# EAGLE design doorbell-controller (EAGLE 8.6.3)
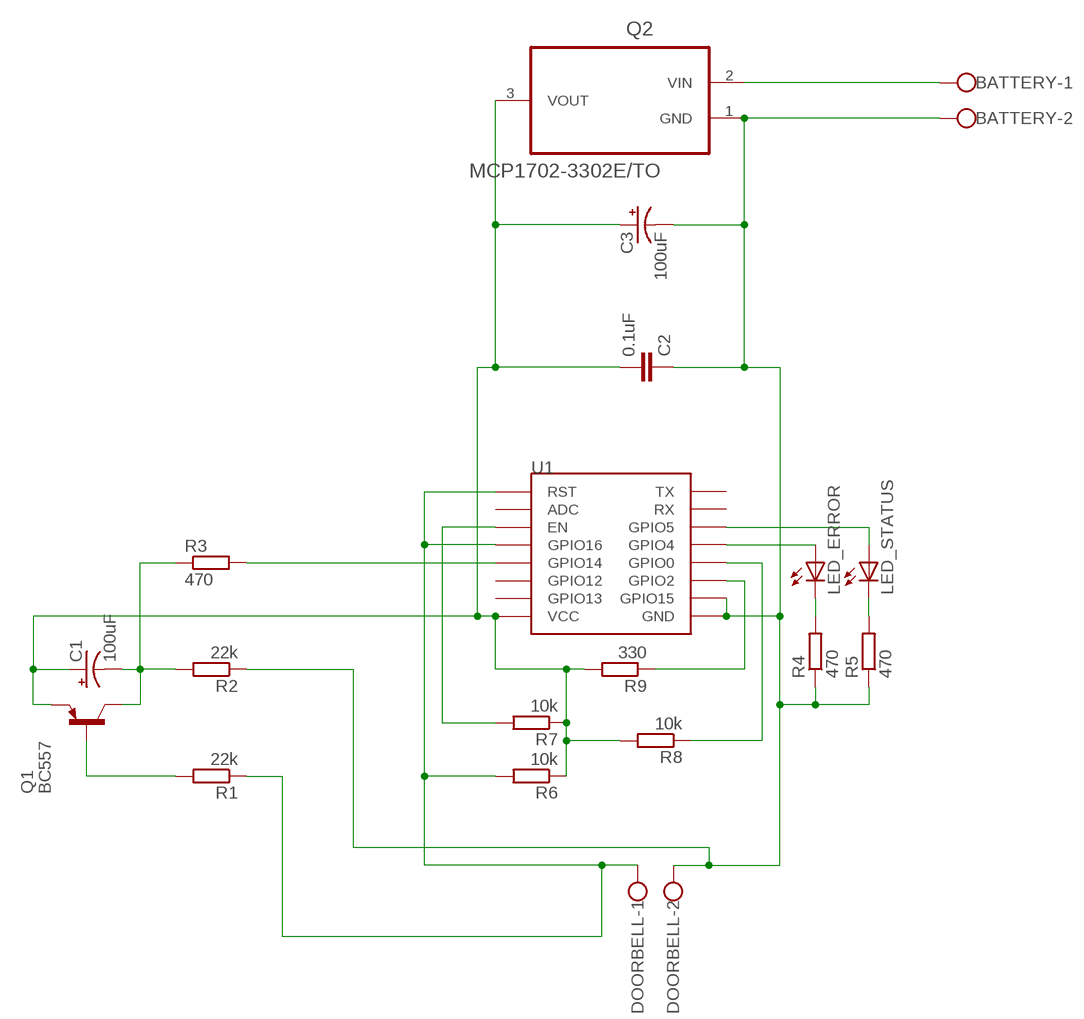
[diagram p0: schematic, sheet 1]

## Parts
BATTERY  W237-102  [W237-102]
C1  100uF  CPOL-USE2,5-6E  [E2,5-6E]
C2  0.1uF  C-EU025-025X050  [C025-025X050]
C3  100uF  CPOL-USE2,5-6E  [E2,5-6E]
DOORBELL  W237-102  [W237-102]
LED_ERROR  LED5MM  [LED5MM]
LED_STATUS  LED5MM  [LED5MM]
Q1  BC557  [TO92]
Q2  MCP1702-3302E/TO  [TO127P254X533-3]
R1  22k  R-EU_0204/7  [0204/7]
R2  22k  R-EU_0204/7  [0204/7]
R3  470  R-EU_0204/7  [0204/7]
R4  470  R-EU_0204/7  [0204/7]
R5  470  R-EU_0204/7  [0204/7]
R6  10k  R-EU_0204/7  [0204/7]
R7  10k  R-EU_0204/7  [0204/7]
R8  10k  R-EU_0204/7  [0204/7]
R9  330  R-EU_0204/7  [0204/7]
U1  ESP12-TR  [ESP12-TR]

## Nets
BATT_VIN: BATTERY.1 Q2.2(VIN)
GND: BATTERY.2 C2.1 C3.- DOORBELL.2 Q2.1(GND) R2.1 R4.1 R5.1 U1.GND U1.GPIO15
N$1: LED_STATUS.A U1.GPIO5
N$2: Q1.2(B) R1.2
N$3: R3.2 U1.GPIO14
N$4: LED_ERROR.A U1.GPIO4
N$5: C1.- Q1.3(C) R2.2 R3.1
N$6: LED_ERROR.K(C) R4.2
N$7: LED_STATUS.K(C) R5.2
N$9: R9.1 U1.GPIO2
N$10: R7.2 U1.EN
N$11: R8.1 U1.GPIO0
RST: DOORBELL.1 R1.1 R6.2 U1.GPIO16 U1.RST
VCC: C1.+ C2.2 C3.+ Q1.1(E) Q2.3(VOUT) R6.1 R7.1 R8.2 R9.2 U1.VCC
Unconnected: U1.ADC U1.GPIO12 U1.GPIO13 U1.RX U1.TX

## Library data of the parts
BATTERY DOORBELL = con-wago-500:W237-102: WAGO SCREW CLAMP; MPN: 237-102; OC_FARNELL: unknown; OC_NEWARK: 70K9898
C1 C3 = rcl:CPOL-US: POLARIZED CAPACITOR, American symbol; SPICEPREFIX: C
C2 = rcl:C-EU: CAPACITOR, European symbol; SPICEPREFIX: C
LED_ERROR LED_STATUS = led:LED: LED OSRAM: - CHIPLED LG R971, LG N971, LY N971, LG Q971, LY Q971, LO R971, LY R971 LH N974, LH R974 LS Q976, LO Q976, LY Q976 LO Q996 - Hyper CHIPLED LW Q18S LB Q993, LB Q99A, LB R99A - SideLED LS A670, LO A670, LY A670, LG A670, LP A670 LB A673, LV A673, LT A673, LW A673 LH A674 LY A675 LS A676, LA A676, LO A676, LY A676, LW A676 LS A679, LY A679, LG A679 - Hyper Micro SIDELED® LS Y876, LA Y876, LO Y876, LY Y876 LT Y87S - SmartLED LW L88C, LW L88S LB L89C, LB L89S, LG L890 LS L89K, LO L89K, LY L89K LS L896, LA L896, LO L896, LY L896 - TOPLED LS T670, LO T670, LY T670, LG T670, LP T670 LSG T670, LSP T670, LSY T670, LOP T670, LYG T670 LG T671, LOG T671, LSG T671 LB T673, LV T673, LT T673, LW T673 LH T674 LS T676, LA T676, LO T676, LY T676, LB T676, LH T676, LSB T676, LW T676 LB T67C, LV T67C, LT T67C, LS T67K, LO T67K, LY T67K, LW E67C LS E67B, LA E67B, LO E67B, LY E67B, LB E67C, LV E67C, LT E67C LW T67C LS T679, LY T679, LG T679 LS T770, LO T770, LY T770, LG T770, LP T770 LB T773, LV T773, LT T773, LW T773 LH T774 LS E675, LA E675, LY E675, LS T675 LS T776, LA T776, LO T776, LY T776, LB T776 LHGB T686 LT T68C, LB T68C - Hyper Mini TOPLED® LB M676 - Mini TOPLED Santana® LG M470 LS M47K, LO M47K, LY M47K Source: http://www.osram.convergy.de LUXEON: - LUMILED® LXK2-PW12-R00, LXK2-PW12-S00, LXK2-PW14-U00, LXK2-PW14-V00 LXK2-PM12-R00, LXK2-PM12-S00, LXK2-PM14-U00 LXK2-PE12-Q00, LXK2-PE12-R00, LXK2-PE12-S00, LXK2-PE14-T00, LXK2-PE14-U00 LXK2-PB12-K00, LXK2-PB12-L00, LXK2-PB12-M00, LXK2-PB14-N00, LXK2-PB14-P00, LXK2-PB14-Q00 LXK2-PR12-L00, LXK2-PR12-M00, LXK2-PR14-Q00, LXK2-PR14-R00 LXK2-PD12-Q00, LXK2-PD12-R00, LXK2-PD12-S00 LXK2-PH12-R00, LXK2-PH12-S00 LXK2-PL12-P00, LXK2-PL12-Q00, LXK2-PL12-R00 Source: www.luxeon.com KINGBRIGHT: KA-3528ASYC Source: www.kingbright.com
Q1 = transistor-pnp:BC557: PNP Transistor
Q2 = Microchip_By_element14_Batch_1:MCP1702-3302E/TO: IC, V REG, LDO, 250MA; MPN: MCP1702-3302E/TO; OC_FARNELL: 1331485; OC_NEWARK: 34M7419; PACKAGE: TO-92; SUPPLIER: Microchip
R1-R9 = rcl:R-EU_: RESISTOR, European symbol; SPICEPREFIX: R
U1 = esp8266modules:ESP12-TR: ESP8266 Wifi module 12

## Board
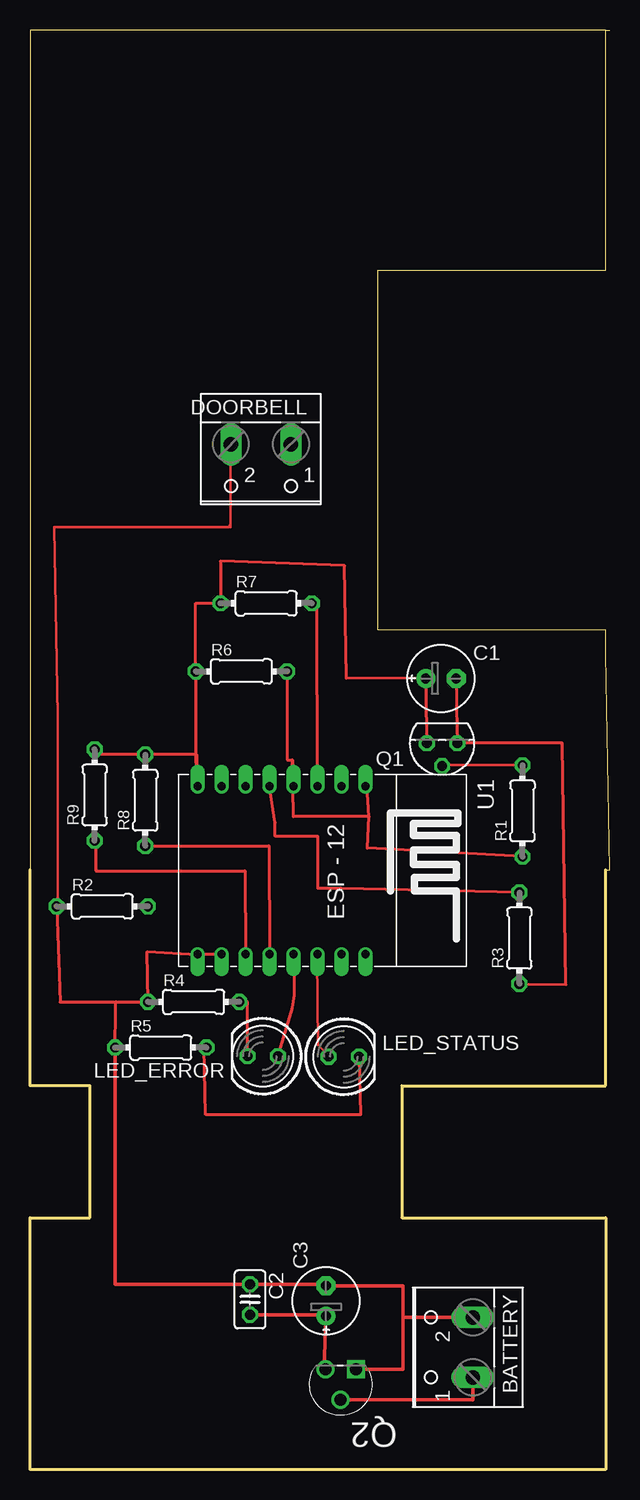
[diagram p1: board, top side]
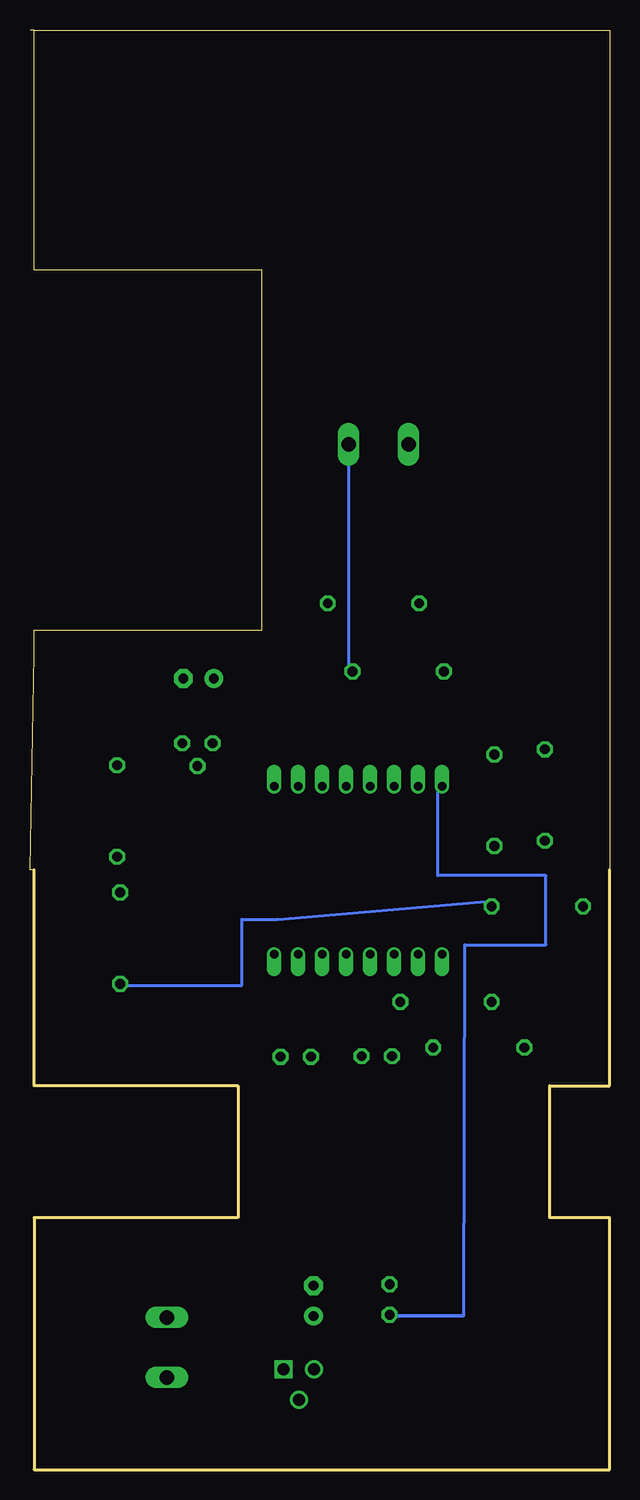
[diagram p2: board, bottom side, seen from below]

Size 48.34 x 120 mm. Coordinates in mm from the lower left corner, seen from the top.
Outline: 48,120 48,100 29,100 29,70 48,70 48,68 48.34,50 48,50 48,32 31,32 31,21 48,21 48,0 0,0 0,21 5,21 5,32 0,32 0,50 0,120 48,120
Outline: 48,120 48.34,120
Copper layers (1*16): Top 0.035mm / dielectric 1.5mm / Bottom 0.035mm
Design rules "default *": minimum track width 8mil, minimum drill 0.35mm, track to track 6mil, track to pad 6mil, pad to pad 6mil, via to via 6mil, smd to smd 6mil, copper to edge 40mil, drill to drill 6mil, minimum pad ring 10mil, minimum via ring 8mil, stop-mask expansion 4mil, vias tented up to drill 0mil, thermal gap 10mil

### Footprints (pad centres in the part's own frame; a part is rotated, then mirrored left to right if it is on the bottom)
W237-102 = drill 1.194 long: 1 -2.5,-1.27; 2 2.5,-1.27
E2,5-6E = drill 0.813 pad 1.575: + -1.27,0 | drill 0.813 pad 1.575 octagon: - 1.27,0
C025-025X050 = drill 0.813 octagon: 1 -1.27,0; 2 1.27,0
LED5MM = drill 0.813 octagon: A -1.27,0; K 1.27,0
TO92 = drill 0.813 octagon: 1 1.27,0; 2 0,1.905; 3 -1.27,0
TO127P254X533-3 = drill 0.991 square: 1 -2.54,-2.54 | drill 0.991: 2 -1.27,0; 3 0,-2.54
0204/7 = drill 0.813 octagon: 1 -3.81,0; 2 3.81,0
ESP12-TR = drill 0.7 offset: ADC -7.1,3.8; EN -7.1,1.8; GND 6.9,-8.2; GPIO0 6.9,-2.2; GPIO2 6.9,-4.2; GPIO4 6.9,-0.2; GPIO5 6.9,1.8; GPIO12 -7.1,-4.2; GPIO13 -7.1,-6.2; GPIO14 -7.1,-2.2; GPIO15 6.9,-6.2; GPIO16 -7.1,-0.2; RST -7.1,5.8; RX 6.9,3.8; TX 6.9,5.8; VCC -7.1,-8.2

### Placement (x,y rotation side)
BATTERY  35.66,10.18 90 top
C1  34.28,65.94 0 top
C2  18.35,14.17 270 top
C3  24.7,14.06 90 top
DOORBELL  19.26,84.2 180 top
LED_ERROR  19.41,34.45 180 top
LED_STATUS  26.18,34.41 0 top
Q1  34.37,60.54 180 top
Q2  24.64,5.82 180 top
R1  41.08,54.9 90 top
R2  6.03,46.95 0 top
R3  40.82,44.29 90 top
R4  13.65,38.98 0 top
R5  10.91,35.18 0 top
R6  17.63,66.53 0 top
R7  19.7,72.21 0 top
R8  9.61,55.79 90 top
R9  5.39,56.22 90 top
U1  22.18,49.85 270 top

### Tracks (layer width: path | path; a pad name or v marks a point on that pad's centre or on a via)
BATT_VIN
  Top 0.305: Q2.2 36.93,5.82 BATTERY.1
GND
  Top 0.203: 16.71,78.56 16.71,85.34 DOORBELL.2 | 16.71,78.56 2.01,78.56 2.31,62.76 2.31,47.12 R2.1 | 16.71,78.56 16.65,78.69
  Top 0.254: U1.GPIO15 U1.GND 9.78,43.17 R4.1 7.16,38.99 | R2.1 2.52,38.96 7.16,38.99 | R5.1 7.14,38.21 7.16,38.99
  Top 0.305: Q2.1 31.1,8.36 31.1,12.68 | 31.1,12.68 BATTERY.2 | 31.1,12.68 31.1,15.33 C3.- 24.7,15.44 C2.1 7.1,15.44 R5.1
N$1
  Top 0.203: U1.GPIO5 23.95,42.79 24,35.38 24.89,34.49 LED_STATUS.A
N$2
  Top 0.254: R1.2 34.74,58.67 Q1.2
N$3
  Top 0.254: R3.2 25.95,48.45 24.01,48.45 24.01,52.77 20.44,52.77 20.44,53.92 U1.GPIO14
N$4
  Top 0.254: LED_ERROR.A 21.88,38.5 22.06,39.55 22.06,43.05 U1.GPIO4
N$5
  Top 0.254: C1.- 35.55,63.45 35.64,60.57 | 35.64,60.57 Q1.3 | R3.1 44.7,40.42 44.38,60.57 35.64,60.57
  Bottom 0.254: R3.1 40.82,40.37 30.67,40.37 30.67,45.86 27.7,45.86 9.84,47.4 R2.2
N$6
  Top 0.254: LED_ERROR.K 18.14,38.98 R4.2
N$7
  Top 0.254: LED_STATUS.K 27.57,29.58 14.66,29.58 14.53,35.17 R5.2
N$9
  Top 0.254: R9.1 5.49,52.41 5.49,49.91 17.92,49.91 U1.GPIO2
N$10
  Top 0.254: U1.EN 23.92,72.21 R7.2
N$11
  Top 0.254: R8.1 19.92,51.98 U1.GPIO0
RST
  Top 0.254: R1.1 28.14,51.79 28.28,54.43 | 28.28,54.43 21.96,54.43 21.88,59.15 | 21.88,59.15 U1.GPIO16 | R6.2 21.44,59.15 21.88,59.15 | 28.28,54.43 28.12,57 U1.RST
  Bottom 0.254: DOORBELL.1 21.76,66.53 R6.2
VCC
  Top 0.254: Q1.1 33.01,63.45 C1.+ 26.39,65.97 26.24,75.34 15.89,75.71 R7.1 13.82,72.21 R6.1 13.82,59.15 U1.VCC 13.92,59.6 R8.2 5.39,59.6 R9.2
  Top 0.305: Q2.3 24.51,8.36 C3.+ 24.7,12.9 C2.2
  Bottom 0.254: 12.18,12.79 12.09,43.73 5.3,43.73 5.3,49.5 14.32,49.5 14.32,56.95 U1.VCC
  Bottom 0.305: 12.18,12.79 18.35,12.79 C2.2